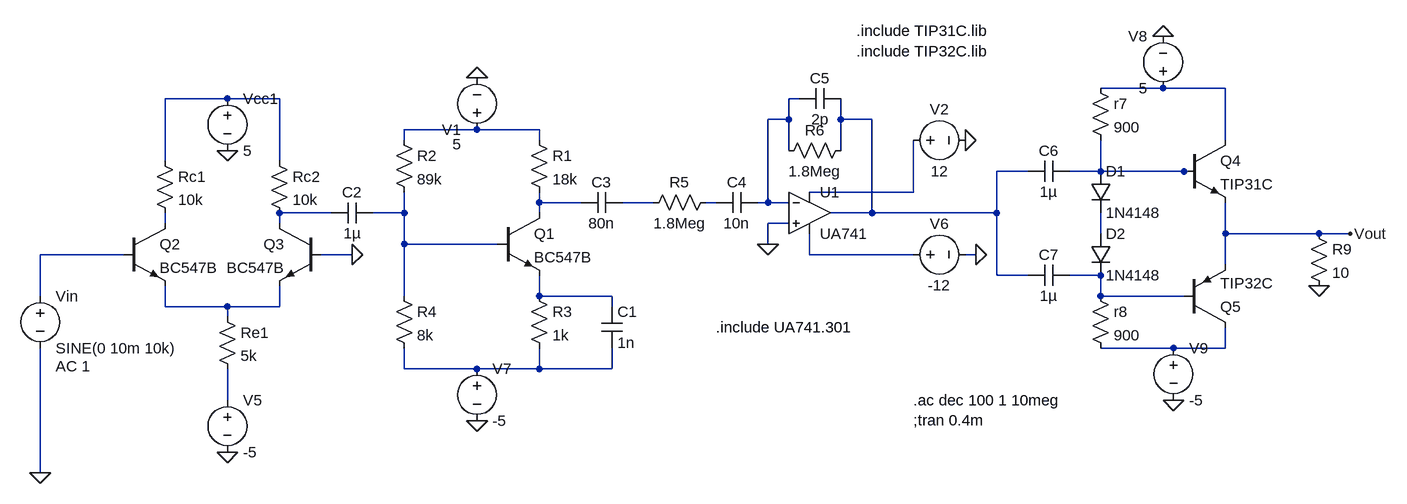
[diagram p0: schematic amp type2.asc]
amp type2.asc, the LTspice schematic file:
Version 4
SHEET 1 2036 680
WIRE 1328 48 1232 48
WIRE 1424 48 1328 48
WIRE -112 64 -208 64
WIRE -32 64 -112 64
WIRE 768 64 752 64
WIRE 752 96 752 64
WIRE 752 96 720 96
WIRE 832 96 832 64
WIRE 880 96 832 96
WIRE 272 112 160 112
WIRE 368 112 272 112
WIRE 160 128 160 112
WIRE 368 128 368 112
WIRE 1424 128 1424 48
WIRE 752 144 752 96
WIRE 832 144 832 96
WIRE -208 160 -208 64
WIRE -32 160 -32 64
WIRE 1120 176 1072 176
WIRE 1232 176 1232 128
WIRE 1232 176 1184 176
WIRE 1360 176 1232 176
WIRE 1376 176 1360 176
WIRE 944 208 944 128
WIRE 944 208 784 208
WIRE 368 224 368 208
WIRE 432 224 368 224
WIRE 544 224 496 224
WIRE 640 224 624 224
WIRE 720 224 720 96
WIRE 720 224 704 224
WIRE 752 224 720 224
WIRE 48 240 -32 240
WIRE 160 240 160 208
WIRE 160 240 112 240
WIRE 368 240 368 224
WIRE 880 240 880 96
WIRE 880 240 816 240
WIRE 1072 240 1072 176
WIRE 1072 240 880 240
WIRE -208 256 -208 240
WIRE -32 256 -32 240
WIRE 752 256 720 256
WIRE 1232 272 1232 240
WIRE 1424 272 1424 224
WIRE 1568 272 1424 272
WIRE 1616 272 1568 272
WIRE 160 288 160 240
WIRE 304 288 160 288
WIRE 720 288 720 256
WIRE -272 304 -400 304
WIRE 80 304 32 304
WIRE 784 304 784 272
WIRE 944 304 784 304
WIRE 1040 304 1024 304
WIRE 1424 320 1424 272
WIRE 1072 336 1072 240
WIRE 1120 336 1072 336
WIRE 1232 336 1184 336
WIRE -400 368 -400 304
WIRE 160 368 160 288
WIRE 368 368 368 336
WIRE 480 368 368 368
WIRE 1232 368 1232 336
WIRE 1360 368 1232 368
WIRE -208 384 -208 352
WIRE -112 384 -208 384
WIRE -32 384 -32 352
WIRE -32 384 -112 384
WIRE 480 384 480 368
WIRE -112 400 -112 384
WIRE 1344 448 1232 448
WIRE 1424 448 1424 416
WIRE 1424 448 1344 448
WIRE 160 480 160 448
WIRE 272 480 160 480
WIRE 368 480 368 448
WIRE 368 480 272 480
WIRE 480 480 480 448
WIRE 480 480 368 480
WIRE -112 528 -112 480
WIRE -400 640 -400 448
FLAG 272 32 0
FLAG -400 640 0
FLAG -112 608 0
FLAG -112 144 0
FLAG 720 288 0
FLAG 1024 128 0
FLAG 272 560 0
FLAG 1328 -32 0
FLAG 1568 352 0
FLAG 1344 528 0
FLAG 80 304 0
FLAG 1616 272 Vout
FLAG 1040 304 0
SYMBOL npn 304 240 R0
SYMATTR InstName Q1
SYMATTR Value BC547B
SYMBOL res 352 112 R0
SYMATTR InstName R1
SYMATTR Value 18k
SYMBOL res 144 112 R0
SYMATTR InstName R2
SYMATTR Value 89k
SYMBOL res 352 352 R0
SYMATTR InstName R3
SYMATTR Value 1k
SYMBOL res 144 352 R0
SYMATTR InstName R4
SYMATTR Value 8k
SYMBOL voltage 272 128 R180
WINDOW 3 24 -6 Left 2
SYMATTR Value 5
SYMATTR InstName V1
SYMBOL cap 112 224 R90
WINDOW 0 0 32 VBottom 2
WINDOW 3 32 32 VTop 2
SYMATTR InstName C2
SYMATTR Value 1µ
SYMBOL cap 464 384 R0
SYMATTR InstName C1
SYMATTR Value 1n
SYMBOL cap 496 208 R90
WINDOW 0 0 32 VBottom 2
WINDOW 3 32 32 VTop 2
SYMATTR InstName C3
SYMATTR Value 80n
SYMBOL res -224 144 R0
SYMATTR InstName Rc1
SYMATTR Value 10k
SYMBOL res -48 144 R0
SYMATTR InstName Rc2
SYMATTR Value 10k
SYMBOL voltage -112 48 R0
WINDOW 123 0 0 Left 0
WINDOW 39 0 0 Left 0
SYMATTR InstName Vcc1
SYMATTR Value 5
SYMBOL npn -272 256 R0
SYMATTR InstName Q2
SYMATTR Value BC547B
SYMBOL res -128 384 R0
SYMATTR InstName Re1
SYMATTR Value 5k
SYMBOL voltage -400 352 R0
WINDOW 123 24 124 Left 2
WINDOW 39 0 0 Left 0
SYMATTR Value2 AC 1
SYMATTR InstName Vin
SYMATTR Value SINE(0 10m 10k)
SYMBOL voltage -112 512 R0
WINDOW 123 0 0 Left 0
WINDOW 39 0 0 Left 0
SYMATTR InstName V5
SYMATTR Value -5
SYMBOL npn 32 256 M0
SYMATTR InstName Q3
SYMATTR Value BC547B
SYMBOL opamp2 784 176 R0
SYMATTR InstName U1
SYMATTR Value UA741
SYMBOL res 640 208 R90
WINDOW 0 0 56 VBottom 2
WINDOW 3 32 56 VTop 2
SYMATTR InstName R5
SYMATTR Value 1.8Meg
SYMBOL res 848 128 R90
WINDOW 0 0 56 VBottom 2
WINDOW 3 32 56 VTop 2
SYMATTR InstName R6
SYMATTR Value 1.8Meg
SYMBOL cap 704 208 R90
WINDOW 0 0 32 VBottom 2
WINDOW 3 32 32 VTop 2
SYMATTR InstName C4
SYMATTR Value 10n
SYMBOL cap 832 48 R90
WINDOW 0 0 32 VBottom 2
WINDOW 3 32 32 VTop 2
SYMATTR InstName C5
SYMATTR Value 2p
SYMBOL voltage 928 128 R270
WINDOW 0 32 56 VTop 2
WINDOW 3 -32 56 VBottom 2
WINDOW 123 0 0 Left 0
WINDOW 39 0 0 Left 0
SYMATTR InstName V2
SYMATTR Value 12
SYMBOL voltage 928 304 R270
WINDOW 0 32 56 VTop 2
WINDOW 3 -32 56 VBottom 2
WINDOW 123 0 0 Left 0
WINDOW 39 0 0 Left 0
SYMATTR InstName V6
SYMATTR Value -12
SYMBOL voltage 272 464 R0
WINDOW 123 0 0 Left 0
WINDOW 39 0 0 Left 0
SYMATTR InstName V7
SYMATTR Value -5
SYMBOL cap 1184 160 R90
WINDOW 0 0 32 VBottom 2
WINDOW 3 32 32 VTop 2
SYMATTR InstName C6
SYMATTR Value 1µ
SYMBOL cap 1184 320 R90
WINDOW 0 0 32 VBottom 2
WINDOW 3 32 32 VTop 2
SYMATTR InstName C7
SYMATTR Value 1µ
SYMBOL res 1216 32 R0
SYMATTR InstName r7
SYMATTR Value 900
SYMBOL res 1216 352 R0
SYMATTR InstName r8
SYMATTR Value 900
SYMBOL npn 1360 128 R0
SYMATTR InstName Q4
SYMATTR Value TIP31C
SYMBOL pnp 1360 416 M180
SYMATTR InstName Q5
SYMATTR Value TIP32C
SYMBOL voltage 1344 432 R0
WINDOW 123 0 0 Left 0
WINDOW 39 0 0 Left 0
SYMATTR InstName V9
SYMATTR Value -5
SYMBOL diode 1216 176 R0
SYMATTR InstName D1
SYMATTR Value 1N4148
SYMBOL diode 1216 272 R0
SYMATTR InstName D2
SYMATTR Value 1N4148
SYMBOL res 1552 256 R0
SYMATTR InstName R9
SYMATTR Value 10
SYMBOL voltage 1328 64 R180
WINDOW 0 24 96 Left 2
WINDOW 3 24 16 Left 2
SYMATTR InstName V8
SYMATTR Value 5
TEXT 640 416 Left 2 !.include UA741.301
TEXT 856 -40 Left 2 !.include TIP31C.lib\n.include TIP32C.lib
TEXT 944 528 Left 2 !.ac dec 100 1 10meg\n;tran 0.4m

The netlist it stands for:
* amp type2.asc
Q1 N008 N012 N018 0 BC547B
R1 N005 N008 18k
R2 N005 N012 89k
R3 N018 N021 1k
R4 N012 N021 8k
V1 N005 0 5
C2 N012 N011 1µ
C1 N018 N021 1n
C3 N009 N008 80n
Rc1 N002 N013 10k
Rc2 N002 N011 10k
Vcc1 N002 0 5
Q2 N013 N015 N019 0 BC547B
Re1 N019 N022 5k
Vin N015 0 SINE(0 10m 10k) AC 1
V5 N022 0 -5
Q3 N011 0 N019 0 BC547B
XU1 0 N003 N007 N016 N004 UA741  ; pins In+ In- V+ V- OUT
R5 N010 N009 1.8Meg
R6 N004 N003 1.8Meg
C4 N003 N010 10n
C5 N004 N003 2p
V2 N007 0 12
V6 N016 0 -12
V7 N021 0 -5
C6 N006 N004 1µ
C7 N017 N004 1µ
r7 N001 N006 900
r8 N017 N020 900
Q4 N001 N006 Vout 0 TIP31C
Q5 N020 N017 Vout 0 TIP32C
V9 N020 0 -5
D1 N006 N014 1N4148
D2 N014 N017 1N4148
R9 Vout 0 10
V8 N001 0 5
.model D D
.lib standard.dio
.model NPN NPN
.model PNP PNP
.lib standard.bjt
.include UA741.301
.include TIP31C.lib
.include TIP32C.lib
.ac dec 100 1 10meg
;tran 0.4m
.backanno
.end